# EasyEDA schematic SCH_LED capsensor board_2023-03-21.json
TITLE: Touch Sensor Light Controller; REV: 1.0; Date: 2022-09-21; Sheet: 1/1; Company: Blinkinlabs
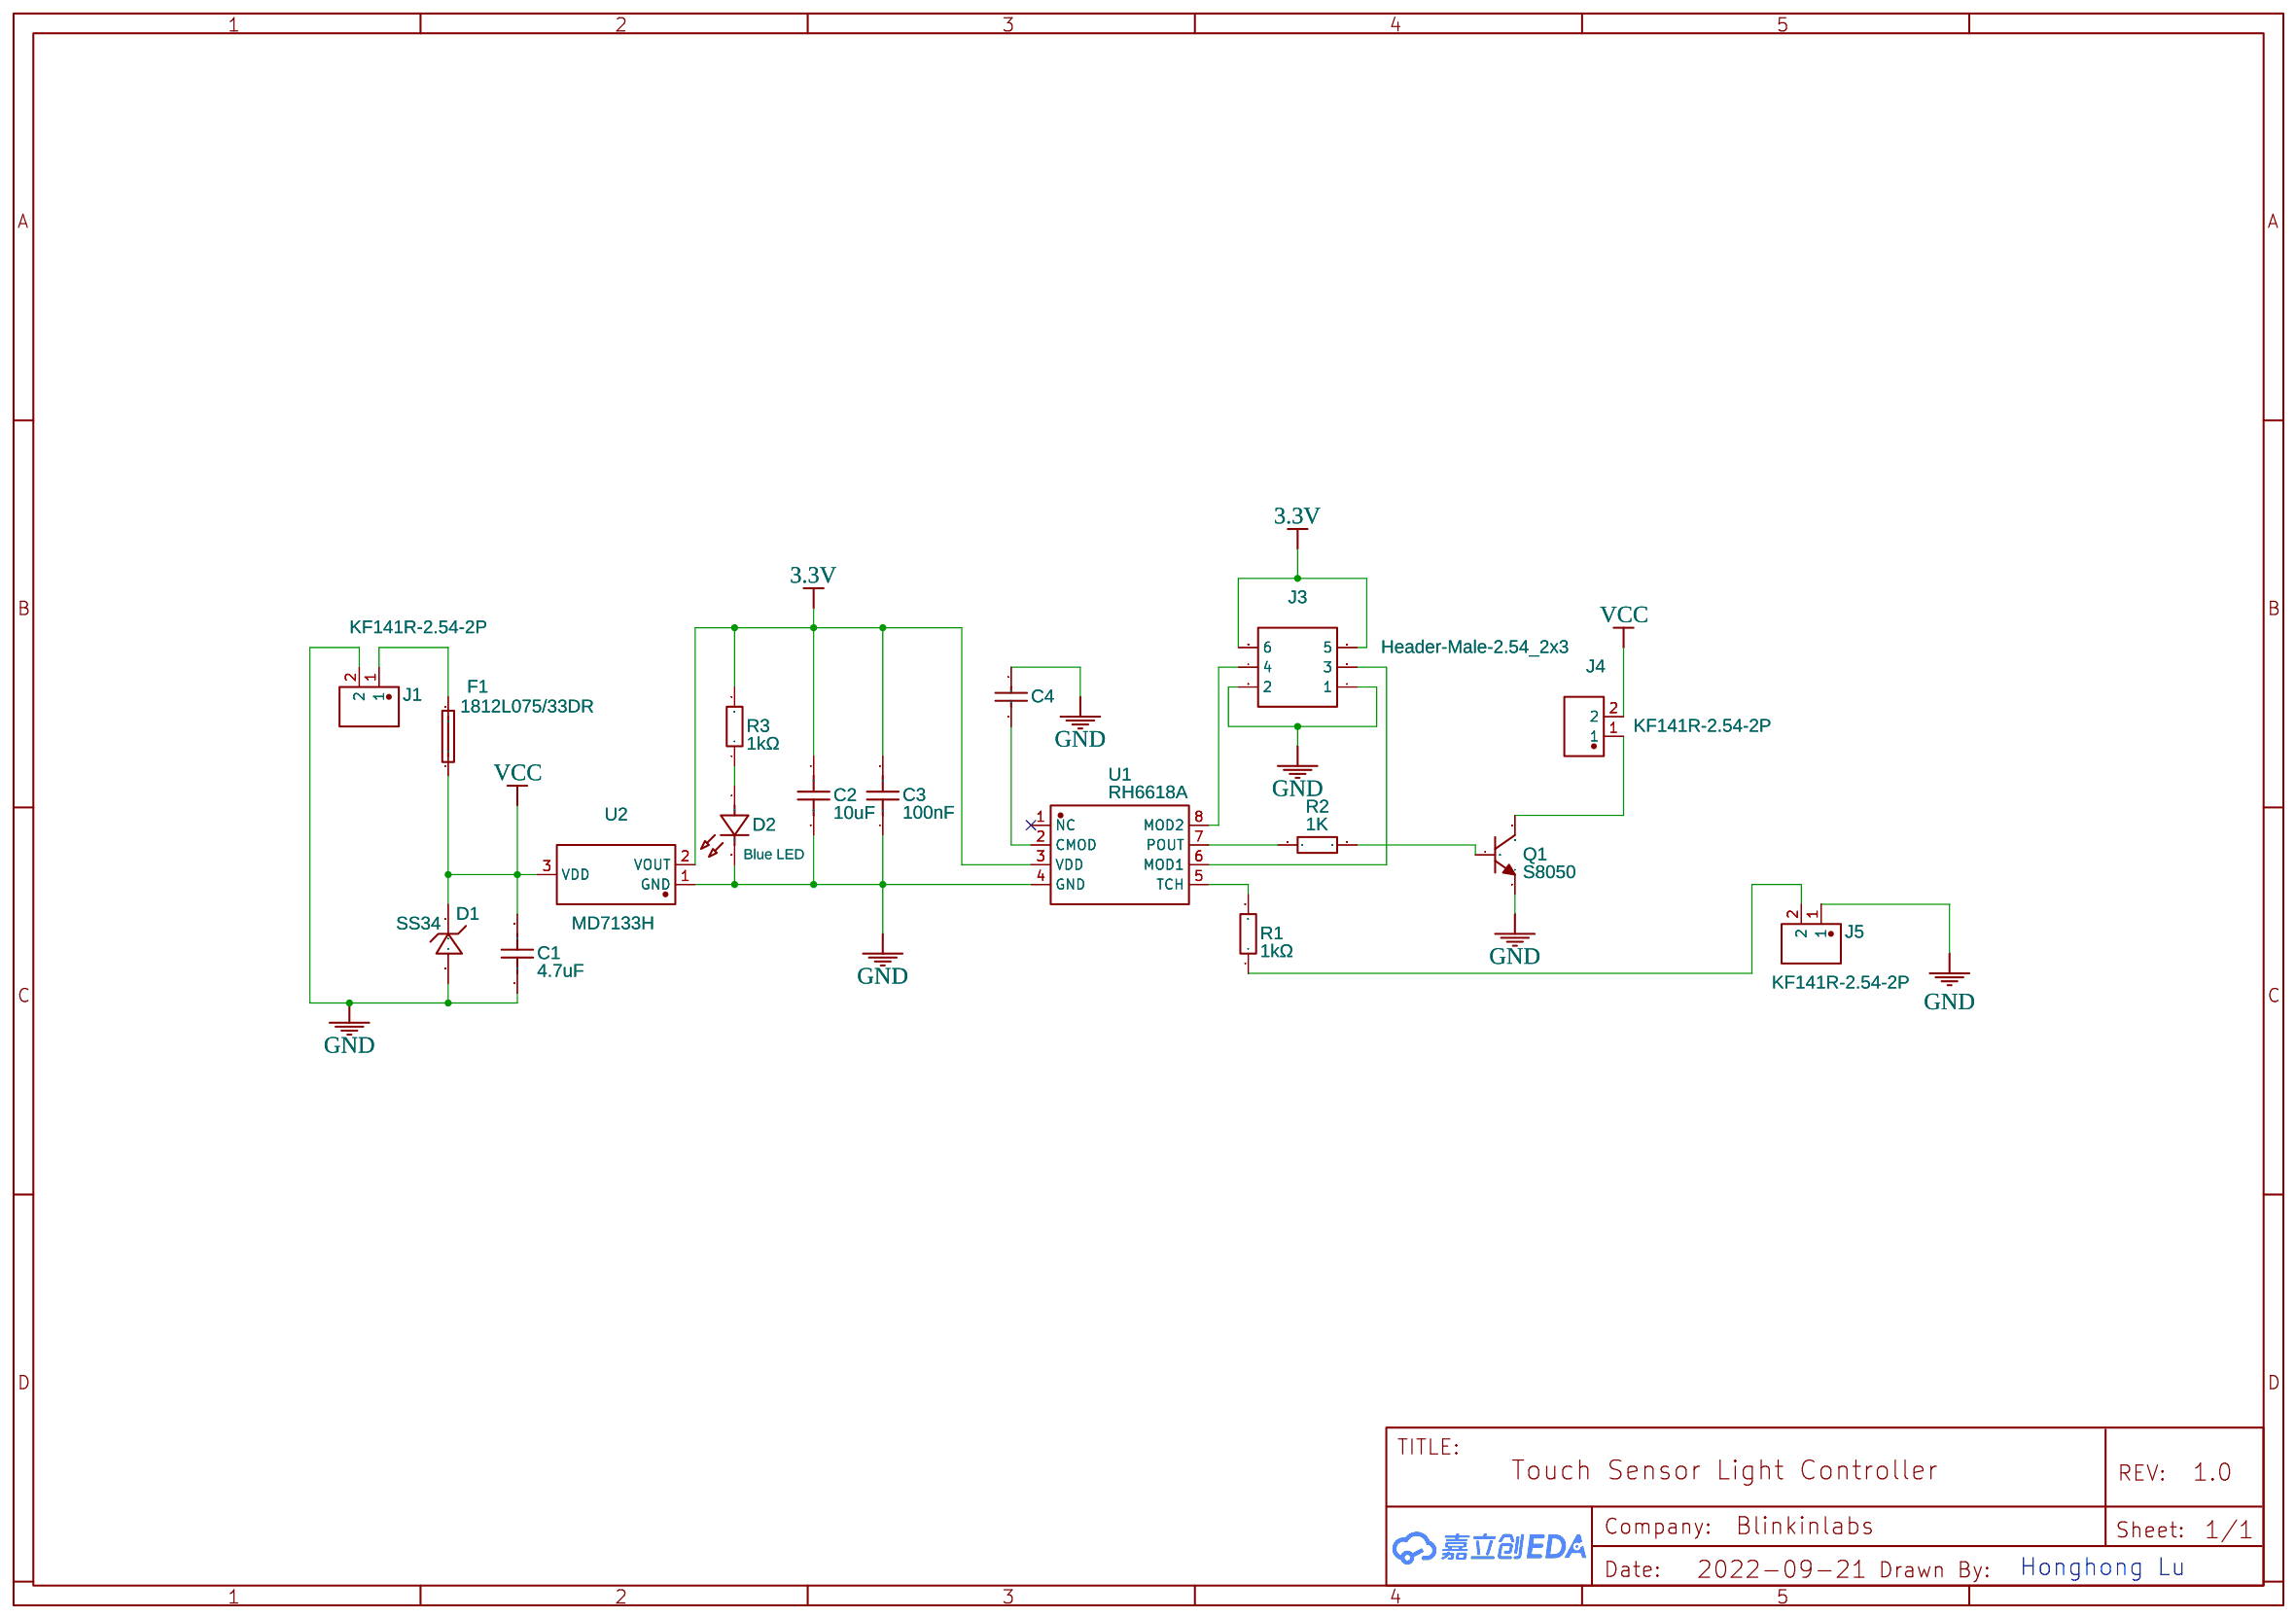
[diagram p0: schematic sheet]

## Parts
C1  4.7uF  [1206]
C2  10uF  [C1206]
C3  100nF  [C0402]
C4  47nF  [C0402]
D1  SS34  [SMA_L4.4-W2.6-LS5.1-RD]
D2  Blue LED  [LED0402-R-RD_RED]
F1  1812L075/33DR  [F1812]
J1  KF141R-2.54-2P  [CONN-TH_2P-P2.54_KF141R-2.54-2P]
J3  Header-Male-2.54_2x3  [HDR-TH_6P-P2.54-V-M-R2-C3-S2.54-1]
J4  KF141R-2.54-2P  [CONN-TH_2P-P2.54_KF141R-2.54-2P]
J5  KF141R-2.54-2P  [CONN-TH_2P-P2.54_KF141R-2.54-2P]
Q1  S8050  [SOT-23-3_L3.0-W1.7-P0.95-LS2.9-BR]
R1  1kΩ  [R0402]
R2  1K  [R0402]
R3  1kΩ  [R0402]
U1  RH6618A  [SOP-8_L4.9-W3.9-P1.27-LS6.0-BL]
U2  MD7133H  [SOT-23-3_L2.9-W1.6-P1.90-LS2.8-BR]

## Library data of the parts
C1 = TCC1206X7R106K160HT: Supplier: LCSC; Supplier Part: C92855; Manufacturer: TAIYO YUDEN(太诱); Manufacturer Part: UMK316BJ475KL-T; Contributor: LCSC; JLCPCB Part Class: Extended Part
C2 = TCC1206X7R106K160HT: Supplier: LCSC; Supplier Part: C380363; Manufacturer: CCTC; Contributor: LCSC; JLCPCB Part Class: Extended Part
C3 = CL05B104KB54PNC: Supplier: LCSC; Supplier Part: C307331; Manufacturer: Samsung Electro-Mechanics; Contributor: LCSC; JLCPCB Part Class: Basic Part
C4 = 0402CG120J500NT: Supplier: LCSC; Manufacturer: Yageo; Manufacturer Part: CC0402KRX7R9BB473; Supplier Part: C272875; JLCPCB Part Class: Basic Part
D1 = SS34A_C2886580: Supplier: LCSC; Supplier Part: C2923966; Manufacturer: CJ(江苏长电/长晶); JLCPCB Part Class: Extended Part; Contributor: lcsc
D2 = XL-1005SURC: Supplier: LCSC; Supplier Part: C131223; Manufacturer: EVERLIGHT(亿光); Manufacturer Part: 16-213/BHC-AN1P2/3T; JLCPCB Part Class: Extended Part; Contributor: LCSC
F1 = TLC-MSMD150/20: Supplier: LCSC; Supplier Part: C151170; Manufacturer: Littelfuse(美国力特); Contributor: LCSC; JLCPCB Part Class: Extended Part
J1 J4 J5 = KF141R-2.54-2P: Supplier: LCSC; Supplier Part: C475124; Manufacturer: Cixi Kefa Elec; Contributor: LCSC; JLCPCB Part Class: Extended Part
J3 = Header-Male-2.54_2x3: Supplier: LCSC; Manufacturer: BOOMELE; Supplier Part: C65114; JLCPCB Part Class: Extended Part
Q1 = S8050_C2146: Supplier: LCSC; Manufacturer: CJ; Supplier Part: C2146; JLCPCB Part Class: Basic Part
R1 R2 = 0402WGF5101TCE: Supplier: LCSC; Manufacturer: UniOhm; Supplier Part: C25905; Resistance (Ohms): 5.1K; JLCPCB Part Class: Basic Part
R3 = 0402WGF5101TCE: Supplier: LCSC; Manufacturer: UniOhm; Supplier Part: C11702; Resistance (Ohms): 1K; JLCPCB Part Class: Basic Part
U1 = RH6618A: Supplier: LCSC; Supplier Part: C511706; Manufacturer: RONGHE Microelectronics; Contributor: LCSC; JLCPCB Part Class: Extended Part
U2 = MD7133H_C920377: Supplier: LCSC; Supplier Part: C920377; Manufacturer: Shanghai Mingda Microelectronics; Contributor: LCSC; JLCPCB Part Class: Extended Part

## Nets
3.3V: C2.1 C3.2 J3.5 J3.6 R3.2 U1.3(VDD) U2.2(VOUT)
GND: C1.1 C2.2 C3.1 C4.2 D1.2 D2.2(A) J1.2 J3.1 J3.2 J5.1 Q1.2(E) U1.4(GND) U2.1(GND)
VCC: C1.2 D1.1 F1.1 J4.2 U2.3(VDD)
Net-(C4-1): C4.1 U1.2(CMOD)
Net-(D2-1): D2.1(K) R3.1
Net-(F1-2): F1.2 J1.1
Net-(J3-3): J3.3 U1.6(MOD1)
Net-(J3-4): J3.4 U1.8(MOD2)
Net-(J4-1): J4.1 Q1.3(C)
Net-(J5-2): J5.2 R1.1
Net-(Q1-1): Q1.1(B) R2.1
Net-(R1-2): R1.2 U1.5(TCH)
Net-(R2-2): R2.2 U1.7(POUT)

Not connected (* = marked no-connect by the designer): U1 1(NC)*

## Notes on the sheet
- Honghong Lu
